# EAGLE schematic main_v3 (EAGLE 6.3)
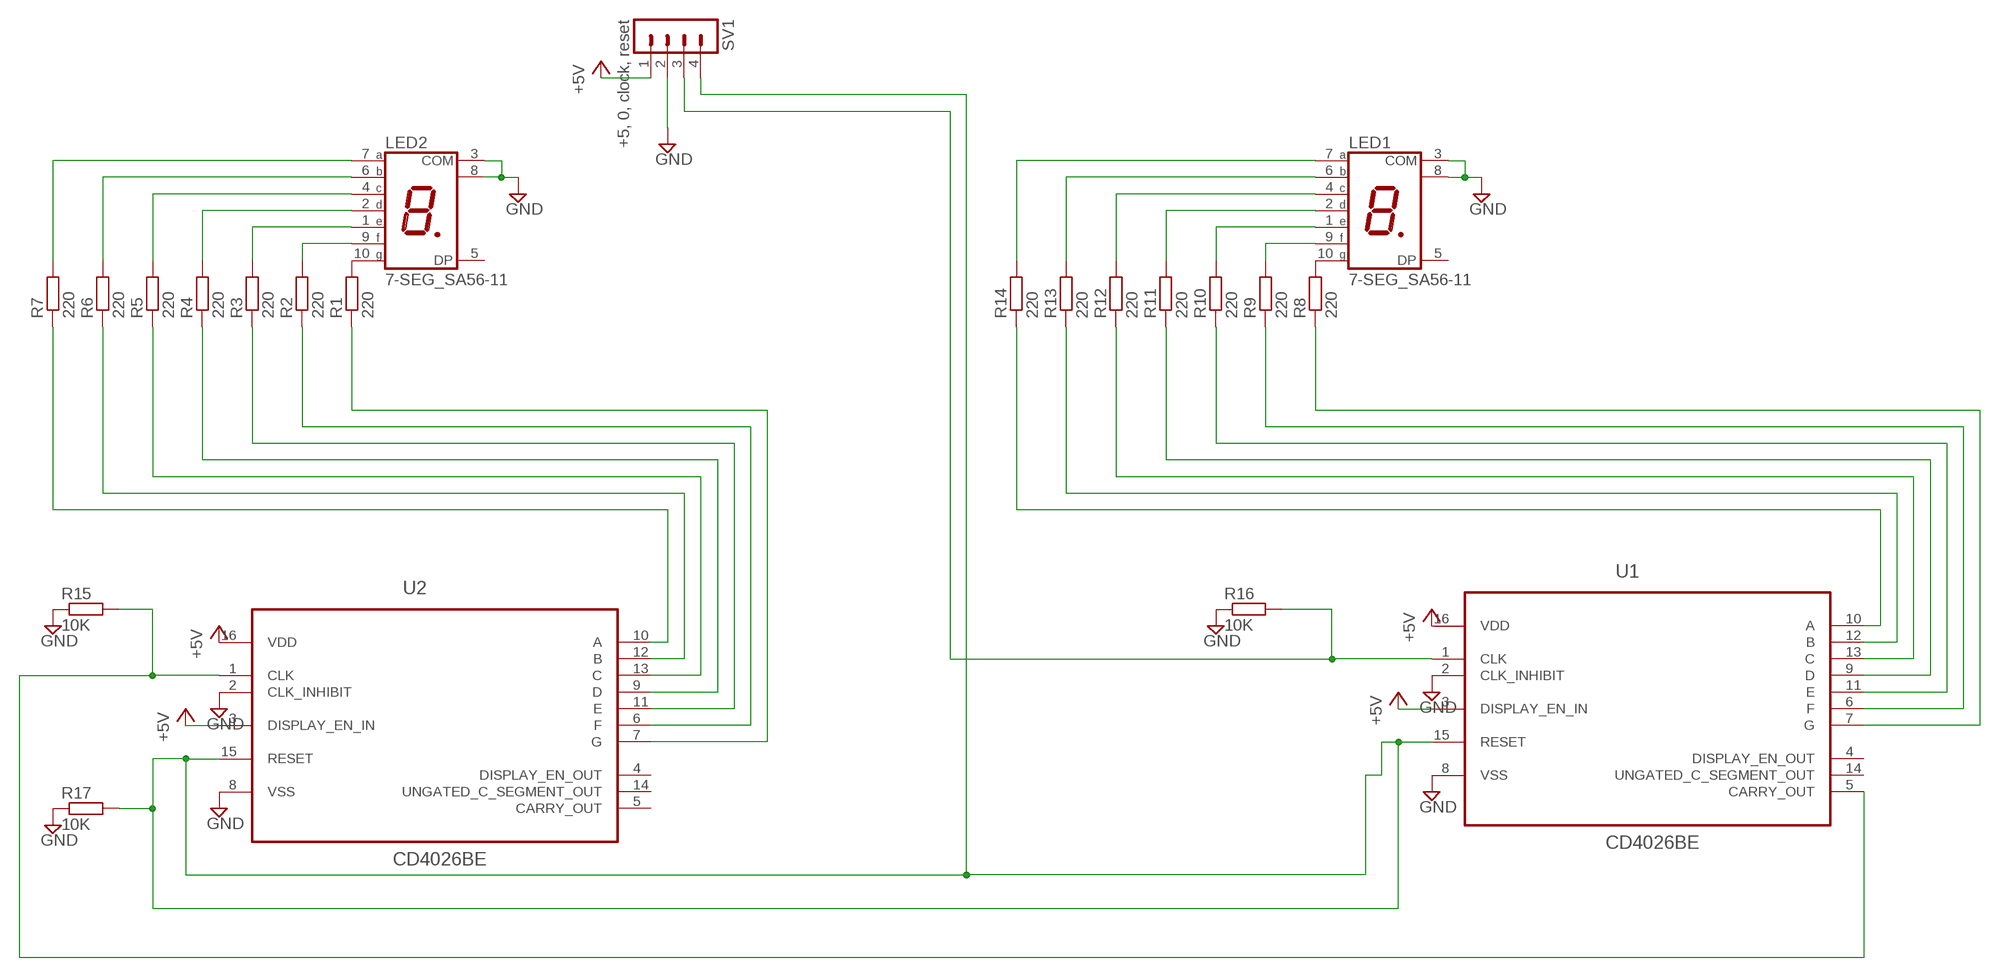
[diagram p0: schematic, sheet 1]

## Parts
LED1  7-SEG_SA56-11  [SA56-11]
LED2  7-SEG_SA56-11  [SA56-11]
R1  220  R-EU_R0805  [R0805]
R2  220  R-EU_R0805  [R0805]
R3  220  R-EU_R0805  [R0805]
R4  220  R-EU_R0805  [R0805]
R5  220  R-EU_R0805  [R0805]
R6  220  R-EU_R0805  [R0805]
R7  220  R-EU_R0805  [R0805]
R8  220  R-EU_R0805  [R0805]
R9  220  R-EU_R0805  [R0805]
R10  220  R-EU_R0805  [R0805]
R11  220  R-EU_R0805  [R0805]
R12  220  R-EU_R0805  [R0805]
R13  220  R-EU_R0805  [R0805]
R14  220  R-EU_R0805  [R0805]
R15  10K  R-EU_R0805  [R0805]
R16  10K  R-EU_R0805  [R0805]
R17  10K  R-EU_R0805  [R0805]
SV1  +5, 0, clock, reset  MA04-1  [MA04-1]
U1  CD4026BE  [DIP254P762X508-16]
U2  CD4026BE  [DIP254P762X508-16]

## Nets
+5V: SV1.1 U1.3(DISPLAY_EN_IN) U1.16(VDD) U2.3(DISPLAY_EN_IN) U2.16(VDD)
GND: LED1.3(COM) LED1.8(COM) LED2.3(COM) LED2.8(COM) R15.1 R16.1 R17.1 SV1.2 U1.2(CLK_INHIBIT) U1.8(VSS) U2.2(CLK_INHIBIT) U2.8(VSS)
N$1: LED2.10(G) R1.2
N$2: LED2.9(F) R2.2
N$3: LED2.1(E) R3.2
N$4: LED2.2(D) R4.2
N$5: LED2.4(C) R5.2
N$6: LED2.6(B) R6.2
N$7: LED2.7(A) R7.2
N$8: R7.1 U2.10(A)
N$9: R6.1 U2.12(B)
N$10: LED1.10(G) R8.2
N$11: LED1.9(F) R9.2
N$12: LED1.1(E) R10.2
N$13: LED1.2(D) R11.2
N$14: LED1.4(C) R12.2
N$15: LED1.6(B) R13.2
N$16: LED1.7(A) R14.2
N$17: R5.1 U2.13(C)
N$18: R3.1 U2.11(E)
N$19: R2.1 U2.6(F)
N$20: R1.1 U2.7(G)
N$21: R14.1 U1.10(A)
N$22: R13.1 U1.12(B)
N$23: R12.1 U1.13(C)
N$24: R11.1 U1.9(D)
N$25: R10.1 U1.11(E)
N$27: R4.1 U2.9(D)
N$28: R9.1 U1.6(F)
N$29: R8.1 U1.7(G)
N$30: R16.2 SV1.3 U1.1(CLK)
N$31: R15.2 U1.5(CARRY_OUT) U2.1(CLK)
N$32: R17.2 SV1.4 U1.15(RESET) U2.15(RESET)
Unconnected: LED1.5(DP) LED2.5(DP) U1.4(DISPLAY_EN_OUT) U1.14(UNGATED_C_SEGMENT_OUT) U2.4(DISPLAY_EN_OUT) U2.5(CARRY_OUT) U2.14(UNGATED_C_SEGMENT_OUT)

## Library data of the parts
LED1 LED2 = display-kingbright:7-SEG_: Kingbright 14.2mm (0.56 INCH) SINGLE DIGIT NUMERIC DUISPLAY Source: SA56-11EWA(Ver1189471036.pdf; OC_FARNELL: unknown; OC_NEWARK: unknown
R1-R17 = resistor:R-EU_: RESISTOR, European symbol
SV1 = con-lstb:MA04-1: PIN HEADER; OC_FARNELL: unknown; OC_NEWARK: unknown
U1 U2 = Texas Instruments_By_element14_Batch_1:CD4026BE: DECADE COUNTERS/DIVIDERS; MPN: CD4026BE; OC_FARNELL: 1703295; OC_NEWARK: 64K3092; PACKAGE: 16-DIP; SUPPLIER: Texas Instruments